# EAGLE schematic snuselRTC (EAGLE 7.5.0)
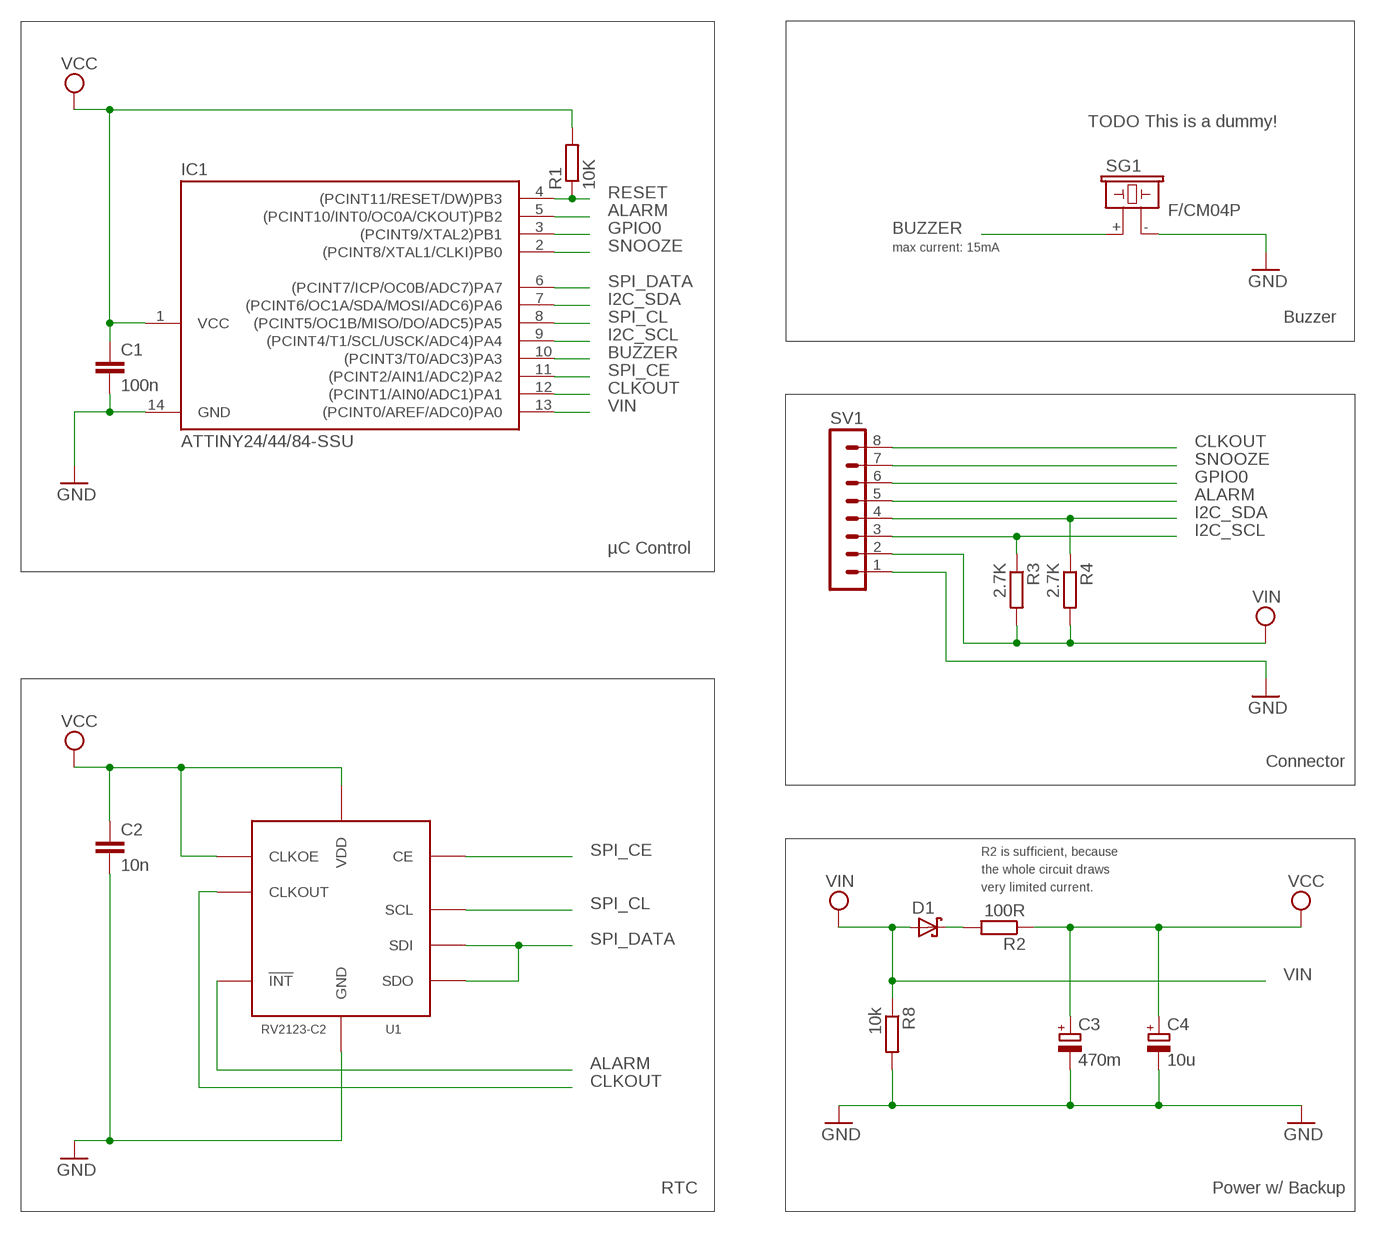
[diagram p0: schematic, sheet 1]

## Parts
C1  100n  C-EUC0805  [C0805]
C2  10n  C-EUC0805  [C0805]
C3  470m  CPOL-EU140CLH-1010  [140CLH-1010]
C4  10u  CPOL-EU140CLH-1010  [140CLH-1010]
D1  SCHOTTKY-DIODESMD  [SMB]
IC1  ATTINY24/44/84-SSU  [SOIC14]
R1  10K  R-EU_R0805  [R0805]
R2  100R  R-EU_R0805  [R0805]
R3  2.7K  R-EU_R0805  [R0805]
R4  2.7K  R-EU_R0805  [R0805]
R8  10k  R-EU_R0805  [R0805]
SG1  F/CM04P  [F/CM04P]
SV1  MA08-1  [MA08-1]
U1  RV2123-C2  [SON_10-PIN]

## Nets
ALARM: IC1.5((PCINT10/INT0/OC0A/CKOUT)PB2) SV1.5 U1.P.8(!INT)
BUZZER: IC1.10((PCINT3/T0/ADC3)PA3) SG1.+
CLKOUT: IC1.12((PCINT1/AIN0/ADC1)PA1) SV1.8 U1.P.2(CLKOUT)
GND: C1.2 C2.2 C3.- C4.- IC1.14(GND) R8.2 SG1.- SV1.1 U1.P.6(GND)
GPIO0: IC1.3((PCINT9/XTAL2)PB1) SV1.6
I2C_SCL: IC1.9((PCINT4/T1/SCL/USCK/ADC4)PA4) R3.1 SV1.3
I2C_SDA: IC1.7((PCINT6/OC1A/SDA/MOSI/ADC6)PA6) R4.1 SV1.4
N$1: D1.C R2.2
RESET: IC1.4((PCINT11/RESET/DW)PB3) R1.1
SNOOZE: IC1.2((PCINT8/XTAL1/CLKI)PB0) SV1.7
SPI_CE: IC1.11((PCINT2/AIN1/ADC2)PA2) U1.P.7(CE)
SPI_CL: IC1.8((PCINT5/OC1B/MISO/DO/ADC5)PA5) U1.P.3(SCL)
SPI_DATA: IC1.6((PCINT7/ICP/OC0B/ADC7)PA7) U1.P.4(SDI) U1.P.5(SDO)
VCC: C1.1 C2.1 C3.+ C4.+ IC1.1(VCC) R1.2 R2.1 R3.2 R4.2 SV1.2 U1.P.1(VDD) U1.P.10(CLKOE) ; supply symbol labelled VIN
VIN: D1.A IC1.13((PCINT0/AREF/ADC0)PA0) R8.1

## Notes on the sheet
- TODO This is a dummy!
- max current: 15mA
- Buzzer
- µC Control
- Connector
- R2 is sufficient, because
- the whole circuit draws
- very limited current.
- RTC | Power w/ Backup

## Library data of the parts
C1 C2 = resistor:C-EU: CAPACITOR, European symbol
C3 C4 = resistor:CPOL-EU: POLARIZED CAPACITOR, European symbol
D1 = diode:SCHOTTKY-DIODE: Schottky Diode
IC1 = attiny24_44_84:ATTINY24/44/84
R1-R4 R8 = resistor:R-EU_: RESISTOR, European symbol
SG1 = buzzer:F/CM04P: BUZZER Source: Buerklin; OC_FARNELL: unknown; OC_NEWARK: unknown
SV1 = con-lstb:MA08-1: PIN HEADER; OC_FARNELL: unknown; OC_NEWARK: unknown
U1 = n39:RV2123-C2: RV 2123-C2: Real Time Clock Module with SPI Bus This RTC IC has been specially designed to achieve an ultra-low power consumption of typically 130nA @ VDD 3.0V in time-keeping mode. The very small SMT ceramic-package combines the 32.768 kHz crystal unit with the CMOS-based oscillator and real-time-clock circuitry. The calendar function tracks year, month, date, and day-of-the-week with built-in century and leap-year flags. The clock function tracks minute and second in 24-hour format. Programmable alarm setting and universal timer functions increase flexibility. This parts comes with visible VCC and GND pins to facilitate battery-backup schematics.; REICHELT: RV 2123-C2